# EAGLE schematic io2 (EAGLE 7.7.0)
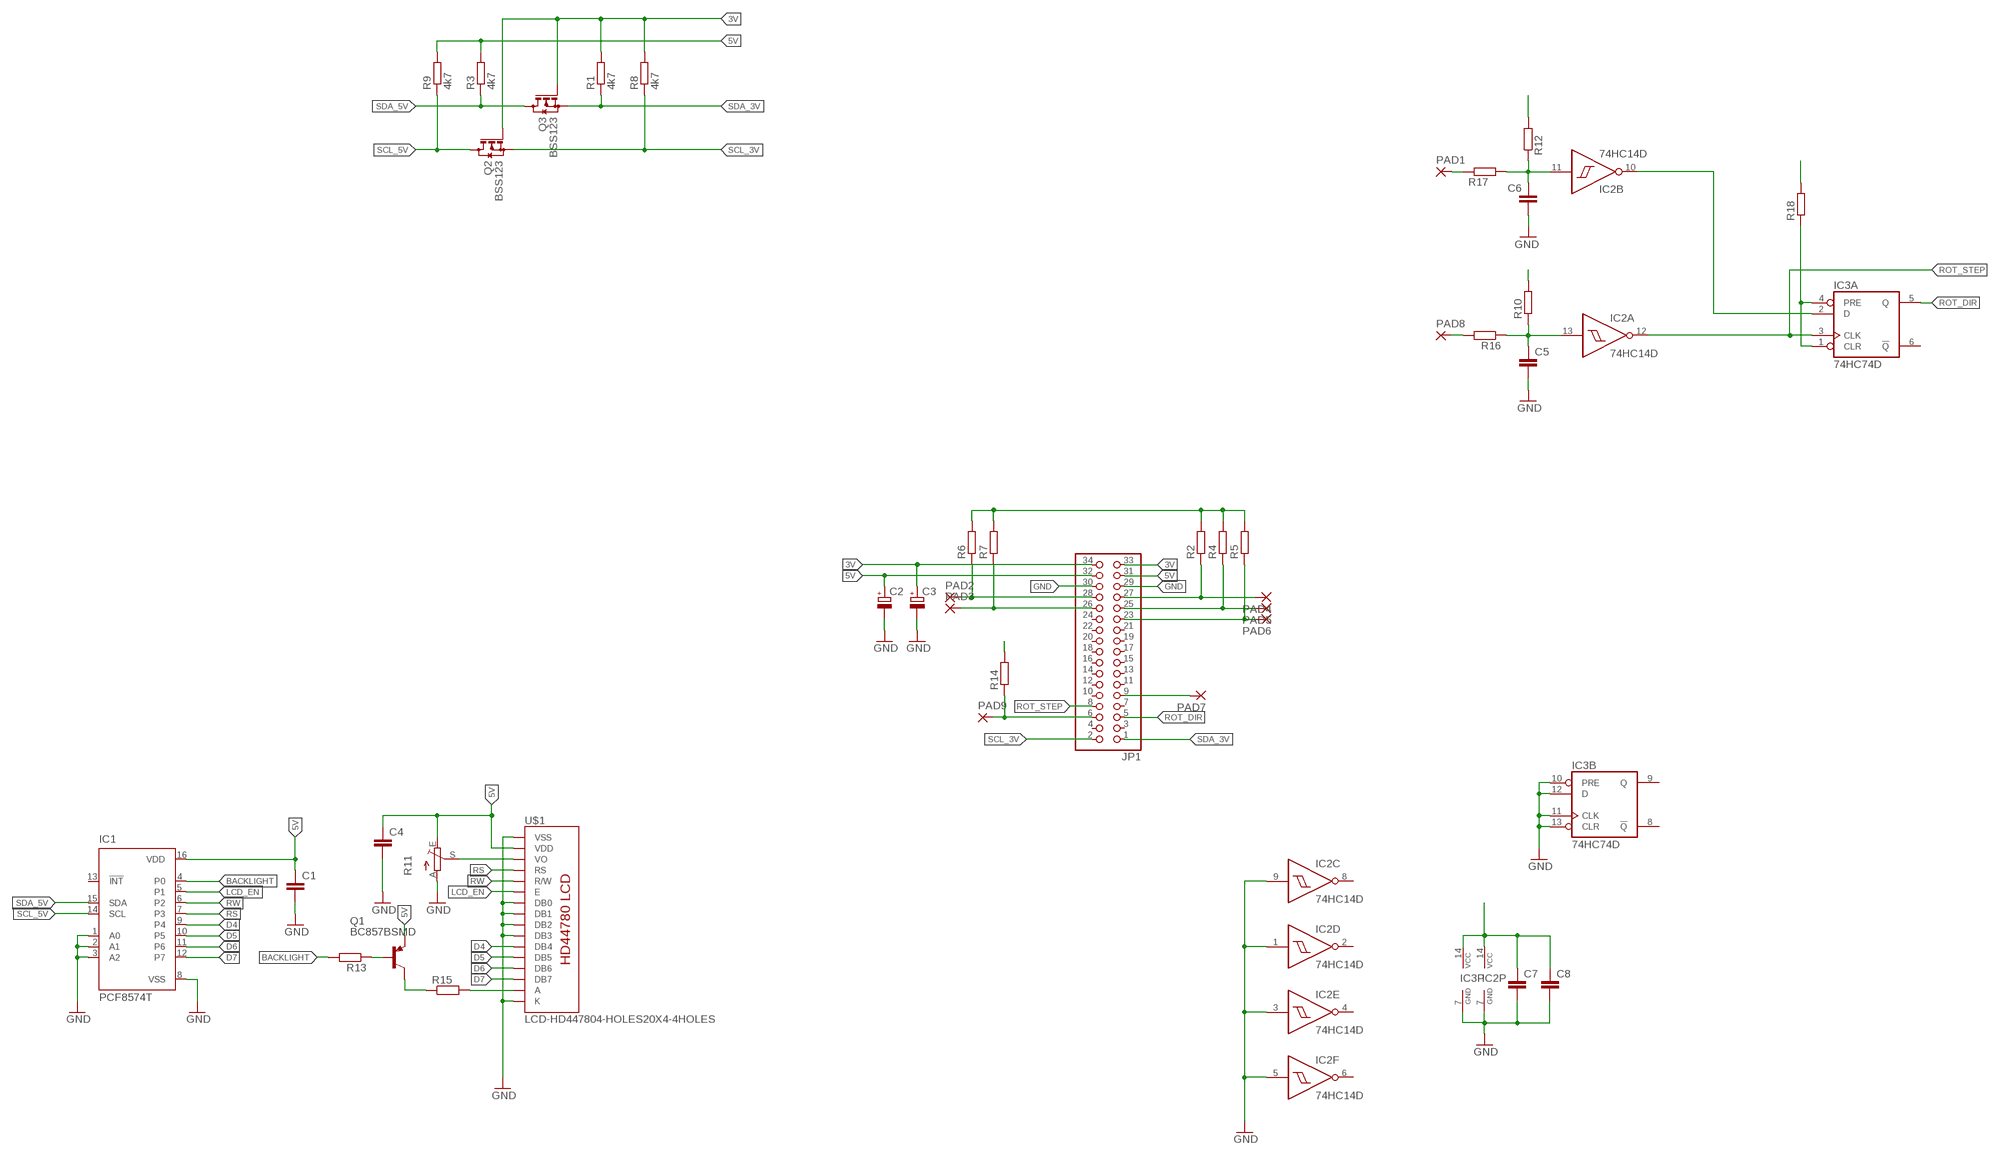
[diagram p0: schematic, sheet 1]

## Parts
C1  C-EUC0603  [C0603]
C2  CPOL-EUSMCD  [SMC_D]
C3  CPOL-EUSMCB  [SMC_B]
C4  C-EUC1206  [C1206]
C5  C-EUC0603  [C0603]
C6  C-EUC0603  [C0603]
C7  C-EUC0603  [C0603]
C8  C-EUC0603  [C0603]
IC1  PCF8574T  [SO16W]
IC2  74HC14D  [SO14]
IC3  74HC74D  [SO14]
JP1  PINHD-2X17_2.54-SMD  [2X17SMD]
PAD1  SMD2  [SMD1,27-2,54]
PAD2  SMD2  [SMD1,27-2,54]
PAD3  SMD2  [SMD1,27-2,54]
PAD4  SMD2  [SMD1,27-2,54]
PAD5  SMD2  [SMD1,27-2,54]
PAD6  SMD2  [SMD1,27-2,54]
PAD7  SMD2  [SMD1,27-2,54]
PAD8  SMD2  [SMD1,27-2,54]
PAD9  SMD2  [SMD1,27-2,54]
Q1  BC857BSMD  [SOT23-BEC]
Q2  BSS123  [SOT23]
Q3  BSS123  [SOT23]
R1  4k7  R-EU_R0603  [R0603]
R2  R-EU_0204/7  [0204/7]
R3  4k7  R-EU_R0603  [R0603]
R4  R-EU_0204/7  [0204/7]
R5  R-EU_0204/7  [0204/7]
R6  R-EU_0204/7  [0204/7]
R7  R-EU_0204/7  [0204/7]
R8  4k7  R-EU_R0603  [R0603]
R9  4k7  R-EU_R0603  [R0603]
R10  R-EU_0204/7  [0204/7]
R11  TRIM_EU-B25U  [B25U]
R12  R-EU_0204/7  [0204/7]
R13  R-EU_0207/12  [0207/12]
R14  R-EU_0204/5  [0204/5]
R15  R-EU_R0603  [R0603]
R16  R-EU_R0603  [R0603]
R17  R-EU_R0603  [R0603]
R18  R-EU_0204/7  [0204/7]
U$1  LCD-HD447804-HOLES20X4-4HOLES  [LCD-20X4-4HOLES]

## Nets
3V: C3.+ C7.1 C8.1 IC2.14(P:VCC) IC3.14(P:VCC) JP1.33 JP1.34 Q2.1(G) Q3.1(G) R1.2 R2.2 R4.2 R5.2 R6.2 R7.2 R8.2 R10.2 R12.2 R14.2 R18.2
5V: C1.1 C2.+ C4.1 IC1.16(VDD) JP1.31 JP1.32 Q1.E R3.2 R9.2 R11.E U$1.P$2(VDD)
BACKLIGHT: IC1.4(P0) R13.2
D4: IC1.9(P4) U$1.P$11(DB4)
D5: IC1.10(P5) U$1.P$12(DB5)
D6: IC1.11(P6) U$1.P$13(DB6)
D7: IC1.12(P7) U$1.P$14(DB7)
GND: C1.2 C2.- C3.- C4.2 C5.2 C6.2 C7.2 C8.2 IC1.1(A0) IC1.2(A1) IC1.3(A2) IC1.8(VSS) IC2.1(D:I) IC2.3(E:I) IC2.5(F:I) IC2.7(P:GND) IC2.9(C:I) IC3.7(P:GND) IC3.10(B:PRE) IC3.11(B:CLK) IC3.12(B:D) IC3.13(B:CLR) JP1.29 JP1.30 R11.A U$1.P$1(VSS) U$1.P$7(DB0) U$1.P$8(DB1) U$1.P$9(DB2) U$1.P$10(DB3) U$1.P$16(K)
IR_DATA: JP1.9 PAD7.1(P)
LCD_EN: IC1.5(P1) U$1.P$6(E)
N$1: Q1.C R15.1
N$2: IC3.1(A:CLR) IC3.4(A:PRE) R18.1
N$3: R15.2 U$1.P$15(A)
N$5: PAD8.1(P) R16.2
N$6: Q1.B R13.1
N$7: PAD1.1(P) R17.1
N$14: R11.S U$1.P$3(VO)
ROT_A_DT: C5.1 IC2.13(A:I) R10.1 R16.1
ROT_B_: IC2.10(B:O) IC3.2(A:D)
ROT_B_CLK: C6.1 IC2.11(B:I) R12.1 R17.2
ROT_DIR: IC3.5(A:Q) JP1.5
ROT_STEP: IC2.12(A:O) IC3.3(A:CLK) JP1.8
ROT_SW: JP1.6 PAD9.1(P) R14.1
RS: IC1.7(P3) U$1.P$4(RS)
RW: IC1.6(P2) U$1.P$5(R/W)
S1: JP1.27 PAD4.1(P) R2.1
S2: JP1.28 PAD2.1(P) R6.1
S3: JP1.25 PAD5.1(P) R4.1
S4: JP1.26 PAD3.1(P) R7.1
S5: JP1.23 PAD6.1(P) R5.1
SCL_3V: JP1.2 Q2.2(S) R8.1
SCL_5V: IC1.14(SCL) Q2.3(D) R9.1
SDA_3V: JP1.1 Q3.2(S) R1.1
SDA_5V: IC1.15(SDA) Q3.3(D) R3.1
Unconnected: IC1.13(!INT) IC2.2(D:O) IC2.4(E:O) IC2.6(F:O) IC2.8(C:O) IC3.6(A:!Q) IC3.8(B:!Q) IC3.9(B:Q) JP1.3 JP1.4 JP1.7 JP1.10 JP1.11 JP1.12 JP1.13 JP1.14 JP1.15 JP1.16 JP1.17 JP1.18 JP1.19 JP1.20 JP1.21 JP1.22 JP1.24

## Library data of the parts
C1 C4-C8 = rcl:C-EU: CAPACITOR, European symbol
C2 C3 = rcl:CPOL-EU: POLARIZED CAPACITOR, European symbol
IC1 = micro-philips:PCF8574: I2C-Bus Remote 8-bit I/O expander http://www.semiconductors.philips.com/acrobat_download/datasheets/PCF8574_4.pdf; MPN: PCF8574T/3,512; OC_FARNELL: 1201255; OC_NEWARK: 70R6870
IC2 = 74xx-eu:74*14: Hex schmitt trigger INVERTER
IC3 = 74xx-eu:74*74: Dual D type positive edge triggered FLIP FLOP, preset and clear
JP1 = pinhead-2:PINHD-2X17: PIN HEADER
PAD1-PAD9 = wirepad:SMD2: SMD PAD
Q1 = transistor-pnp:BC857*: PNP Transistror
Q2 Q3 = transistor-small-signal:BSS123: N-CHANNEL MOS FET
R1-R10 R12-R18 = rcl:R-EU_: RESISTOR, European symbol
R11 = pot:TRIM_EU-: POTENTIOMETER
U$1 = HD44780LCD:LCD-HD44780